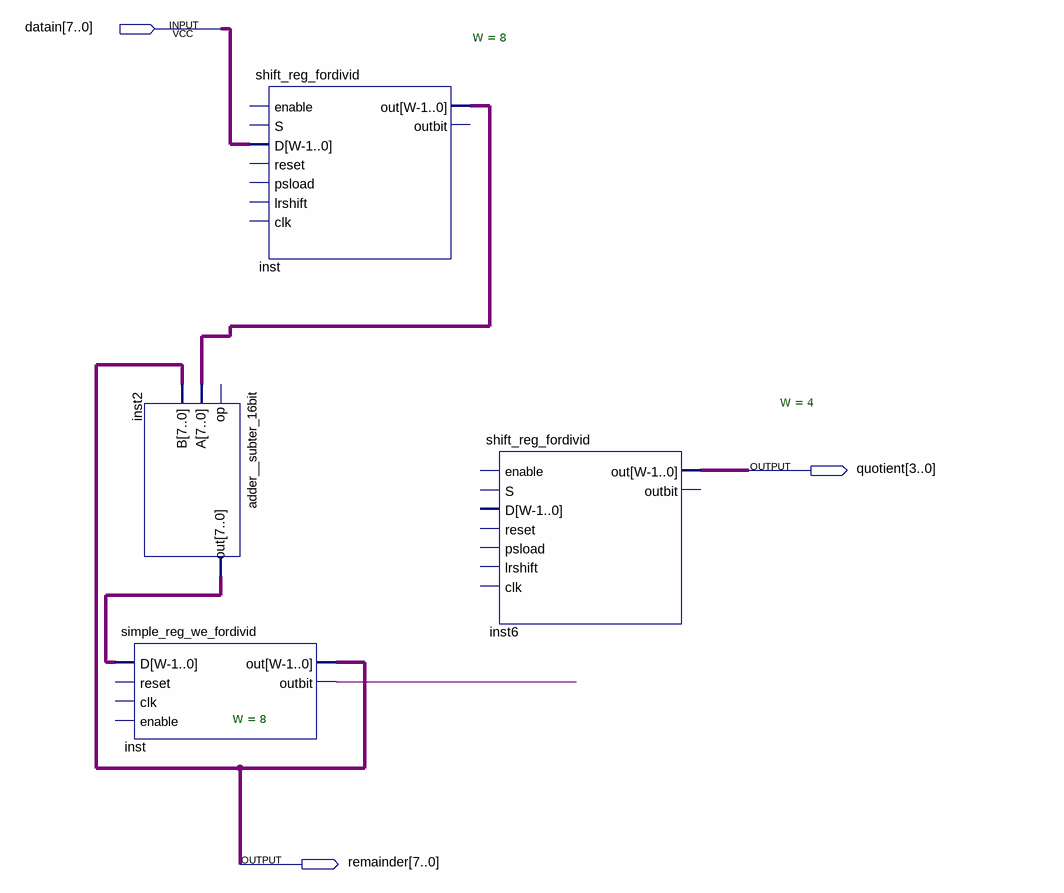
[diagram p0: schematic sheet]
// Quartus schematic schematic_divider.bdf as structural Verilog: 4 symbols, 3 pins
module schematic_divider (
  input  [7:0] datain,
  output [3:0] quotient,
  output [7:0] remainder
);

  wire inst_outbit;
  wire [7:0] inst2_out, inst_out;

  adder__subter_16bit inst2 (.A(inst_out), .B(remainder), .out(inst2_out));  // open: op
  simple_reg_we_fordivid #(.W(8)) inst (
    .D(inst2_out), .out(remainder), .outbit(inst_outbit));  // open: reset, clk, enable
  shift_reg_fordivid #(.W(8)) inst_dup2 (
    .D(datain), .out(inst_out));  // open: enable, S, reset, psload, lrshift, clk, outbit
  shift_reg_fordivid #(.W(4)) inst6 (.out(quotient));  // open: enable, S, D, reset, psload, lrshift, clk, outbit
endmodule
